# EAGLE design stacja prototyp (EAGLE 9.2.2)
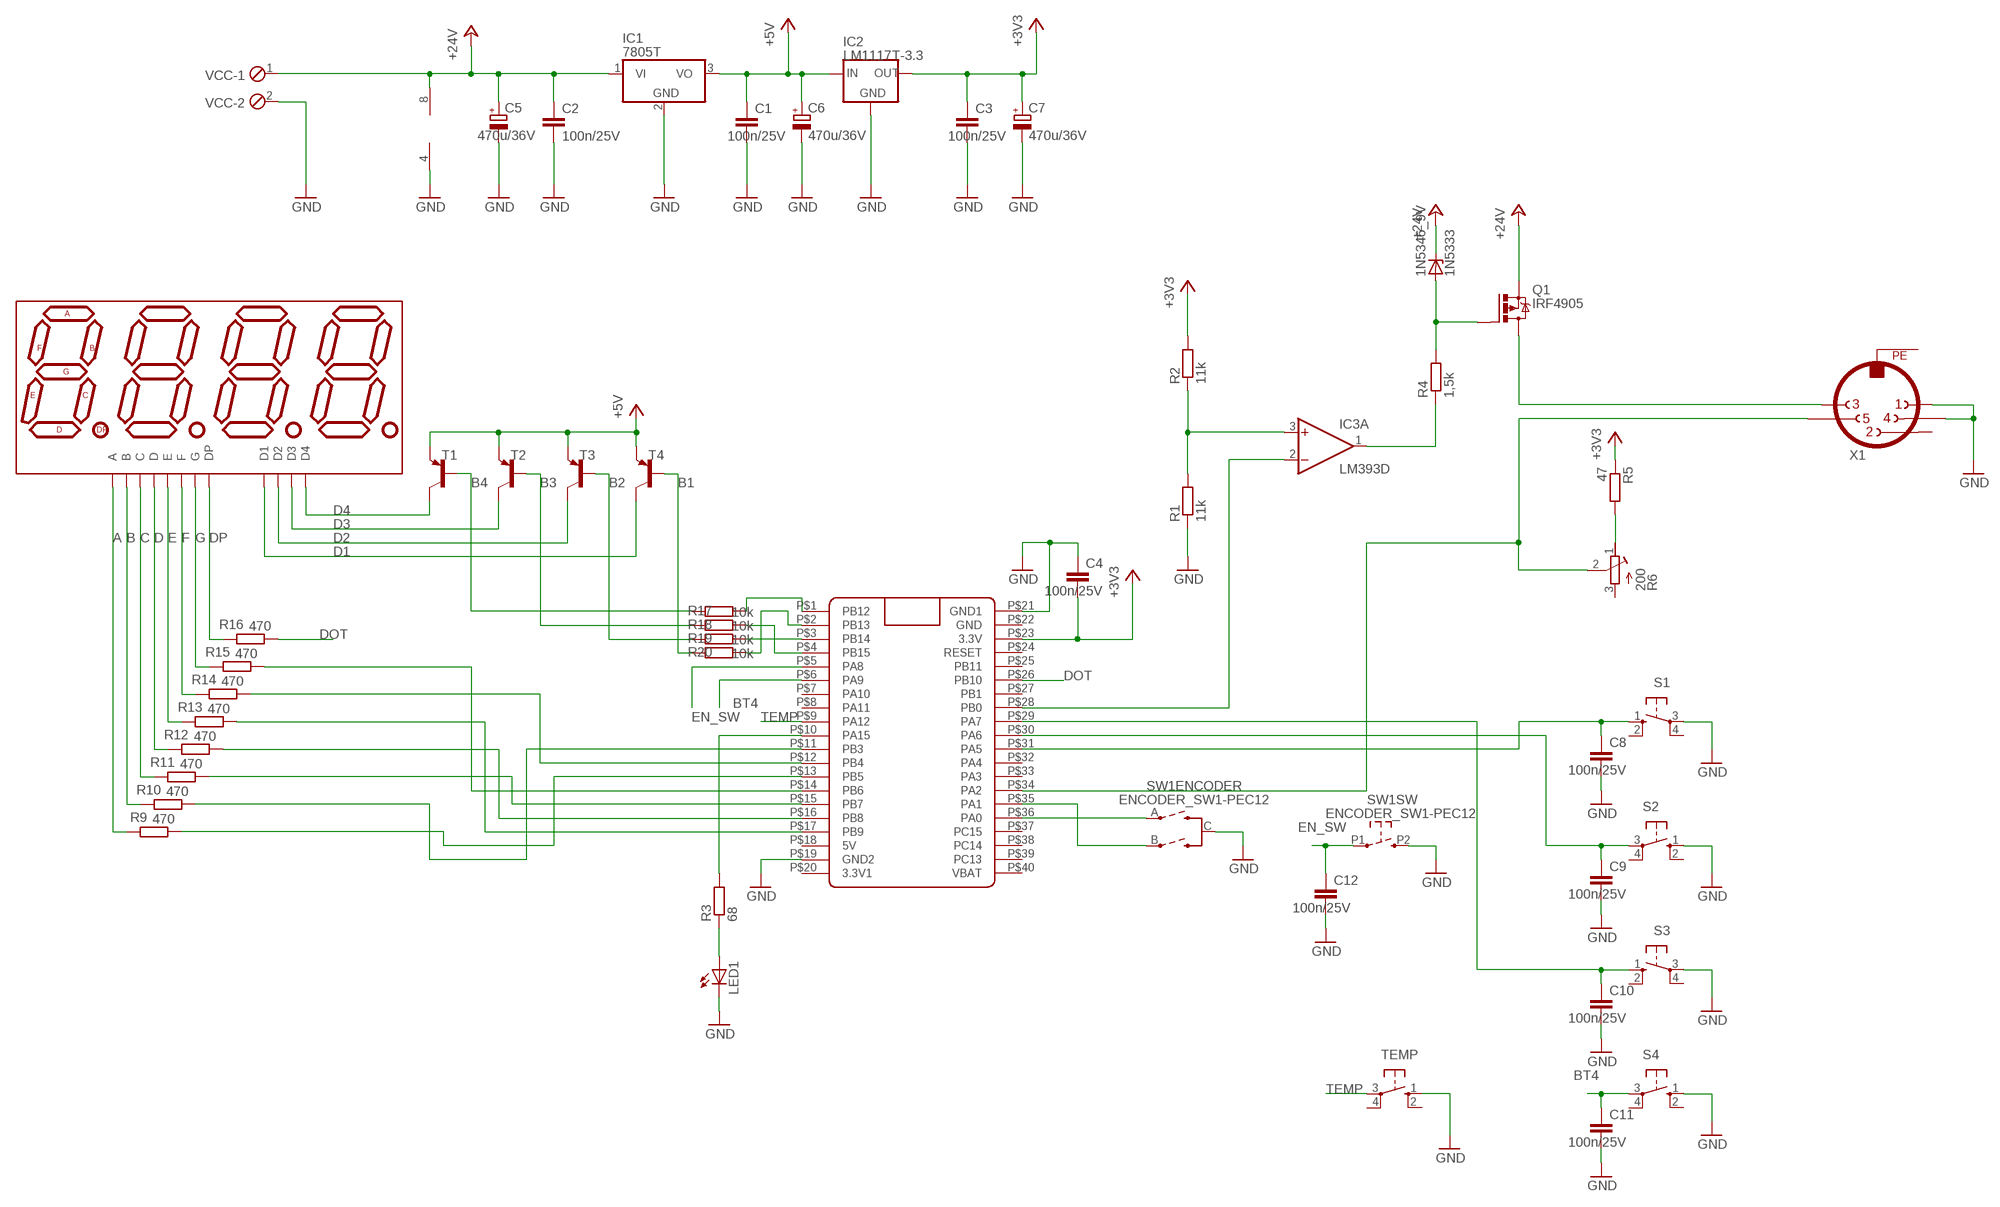
[diagram p0: schematic, sheet 1]

## Parts
1N5346_9V  1N5333  [C1702-15]
C1  100n/25V  C-EUC1206  [C1206]
C2  100n/25V  C-EUC1206  [C1206]
C3  100n/25V  C-EUC1206  [C1206]
C4  100n/25V  C-EUC1206  [C1206]
C5  470u/36V  CPOL-EUE2.5-5  [E2,5-5]
C6  470u/36V  CPOL-EUE2.5-5  [E2,5-5]
C7  470u/36V  CPOL-EUE2.5-5  [E2,5-5]
C8  100n/25V  C-EUC1206  [C1206]
C9  100n/25V  C-EUC1206  [C1206]
C10  100n/25V  C-EUC1206  [C1206]
C11  100n/25V  C-EUC1206  [C1206]
C12  100n/25V  C-EUC1206  [C1206]
DISP1  ATA8041ARBJ  7-SEGMENT-4DIGIT-20MM-RED  [7-SEGMENT-4DIGIT-20MM]
IC1  7805T  [TO220H]
IC2  LM1117T-3.3  [TO220]
IC3  LM393D  [SO08]
LED1  LED5MM  [LED5MM]
Q1  IRF4905  [TO220BH]
R1  11k  R-EU_R0805  [R0805]
R2  11k  R-EU_R0805  [R0805]
R3  68  R-EU_R0805  [R0805]
R4  1,5k  R-EU_0207/15  [0207/15]
R5  47  R-EU_0207/15  [0207/15]
R6  200  R-TRIMM43P  [RTRIM43P]
R9  470  R-EU_M0805  [M0805]
R10  470  R-EU_M0805  [M0805]
R11  470  R-EU_M0805  [M0805]
R12  470  R-EU_M0805  [M0805]
R13  470  R-EU_M0805  [M0805]
R14  470  R-EU_M0805  [M0805]
R15  470  R-EU_M0805  [M0805]
R16  470  R-EU_M0805  [M0805]
R17  10k  R-EU_M0805  [M0805]
R18  10k  R-EU_M0805  [M0805]
R19  10k  R-EU_M0805  [M0805]
R20  10k  R-EU_M0805  [M0805]
S1  10-XX  [B3F-10XX]
S2  10-XX  [B3F-10XX]
S3  10-XX  [B3F-10XX]
S4  10-XX  [B3F-10XX]
SW1  ENCODER_SW1-PEC12  [PEC12_INCREMENTAL_ENCODER]
T1  BC857B-PNP-SOT23-BEC  [SOT23-BEC]
T2  BC857B-PNP-SOT23-BEC  [SOT23-BEC]
T3  BC857B-PNP-SOT23-BEC  [SOT23-BEC]
T4  BC857B-PNP-SOT23-BEC  [SOT23-BEC]
TEMP  10-XX  [B3F-10XX]
U$1  BLUE_PILL  [BLUE_PILL]
VCC  MPT2  [2POL254]
X1  MAB5SV  [MAB5SV]

## Nets
+3V3: C3.1 C4.2 C7.+ IC2.2(OUT) R2.2 R5.1 U$1.P$23(3.3V)
+5V: C1.1 C6.+ IC1.3(VO) IC2.3(IN) T1.E T2.E T3.E T4.E
+24V: 1N5346_9V.C C2.1 C5.+ IC1.1(VI) IC3.8(P:V+) Q1.S VCC.1
A: DISP1.11(A) R9.2
B: DISP1.7(B) R10.2
B1: R20.2 T4.B
B2: R19.2 T3.B
B3: R18.2 T2.B
B4: R17.2 T1.B
BT4: C11.1 S4.3(P) U$1.P$6(PA9)
C: DISP1.4(C) R11.2
D: DISP1.2(D) R12.2
D1: DISP1.12(D1) T4.C
D2: DISP1.9(D2) T3.C
D3: DISP1.8(D3) T2.C
D4: DISP1.6(D4) T1.C
DOT: R16.1 U$1.P$26(PB10)
DP: DISP1.3(DP) R16.2
E: DISP1.1(E) R13.2
EN_SW: C12.1 SW1.P1 U$1.P$5(PA8)
F: DISP1.10(F) R14.2
G: DISP1.5(G) R15.2
GND: C1.2 C2.2 C3.2 C4.1 C5.- C6.- C7.- C8.2 C9.2 C10.2 C11.2 C12.2 IC1.2(GND) IC2.1(GND) IC3.4(P:V-) LED1.K(C) R1.1 S1.3(P) S2.1(S) S3.3(P) S4.1(S) SW1.C(ENCODER:C) SW1.P2 TEMP.1(S) U$1.P$19(GND2) U$1.P$21(GND1) VCC.2 X1.1 X1.4
N$1: IC3.2(A:-IN) U$1.P$28(PB0)
N$2: C8.1 S1.1(S) U$1.P$31(PA5)
N$3: C9.1 S2.3(P) U$1.P$30(PA6)
N$4: IC3.3(A:+IN) R1.2 R2.1
N$5: R6.2(S) U$1.P$34(PA2) X1.5
N$6: IC3.1(A:OUT) R4.1
N$7: 1N5346_9V.A Q1.G R4.2
N$8: Q1.D X1.3
N$9: SW1.A(ENCODER:A) U$1.P$36(PA0)
N$10: SW1.B(ENCODER:B) U$1.P$35(PA1)
N$11: LED1.A R3.1
N$12: R3.2 U$1.P$10(PA15)
N$13: R5.2 R6.1(E)
N$14: C10.1 S3.1(S) U$1.P$29(PA7)
N$15: R18.1 U$1.P$4(PB15)
N$16: R19.1 U$1.P$3(PB14)
N$17: R17.1 U$1.P$1(PB12)
N$18: R20.1 U$1.P$2(PB13)
N$19: R13.1 U$1.P$17(PB9)
N$20: R12.1 U$1.P$16(PB8)
N$21: R11.1 U$1.P$15(PB7)
N$22: R15.1 U$1.P$14(PB6)
N$23: R9.1 U$1.P$13(PB5)
N$24: R14.1 U$1.P$12(PB4)
N$25: R10.1 U$1.P$11(PB3)
TEMP: TEMP.3(P) U$1.P$9(PA12)
Unconnected: IC3.5(B:+IN) IC3.6(B:-IN) IC3.7(B:OUT) R6.3(A) S1.2(S1) S1.4(P1) S2.2(S1) S2.4(P1) S3.2(S1) S3.4(P1) S4.2(S1) S4.4(P1) TEMP.2(S1) TEMP.4(P1) U$1.P$7(PA10) U$1.P$8(PA11) U$1.P$18(5V) U$1.P$20(3.3V1) U$1.P$22(GND) U$1.P$24(RESET) U$1.P$25(PB11) U$1.P$27(PB1) U$1.P$32(PA4) U$1.P$33(PA3) U$1.P$37(PC15) U$1.P$38(PC14) U$1.P$39(PC13) U$1.P$40(VBAT) X1.2

## Power pins joined to a net without a drawn wire
PE: X1.PE

## Library data of the parts
1N5346_9V = diode:1N5333: Z DIODE 3.3 V, 5W, 5 percent (Motorola)
C1-C4 C8-C12 = rcl:C-EU: CAPACITOR, European symbol; SPICEPREFIX: C
C5-C7 = rcl:CPOL-EU: POLARIZED CAPACITOR, European symbol; SPICEPREFIX: C
DISP1 = SparkFun-LED:7-SEGMENT-4DIGIT-20MM: 4 Digit 7 Segment Display This is a part for the 4-Digit 7-segment LEDs from Young Sun. Different from the Digikey LEDs, all 16 pins are used. The LONGPADS Variant is used for a test jig, but you may like it because there is more pad to solder to. If you are concerned about routing space, the standard works just fine though. Datasheets: Red <http://cdn.sparkfun.com/datasheets/Components/LED/1LEDREDCC.pdf> Yellow <http://cdn.sparkfun.com/datasheets/Components/LED/1LEDYELCC.pdf> Green <http://cdn.sparkfun.com/datasheets/Components/LED/1LEDGRNCC.pdf> Blue <http://cdn.sparkfun.com/datasheets/Components/LED/1LEDBLUCC.pdf> White <http://cdn.sparkfun.com/datasheets/Components/LED/1LEDWHTCC.pdf> SparkFun Products Raw Components 7-Segment Display - 20mm (Red) <https://www.sparkfun.com/products/11405> (COM-11405) 7-Segment Display - 20mm (Yellow) <https://www.sparkfun.com/products/11406> (COM-11406) 7-Segment Display - 20mm (Green) <https://www.sparkfun.com/products/11407> (COM-11407) 7-Segment Display - 20mm (Blue) <https://www.sparkfun.com/products/11408> (COM-11408) 7-Segment Display - 20mm (White) <https://www.sparkfun.com/products/11409> (COM-11409) Serial Controlled SparkFun OpenSegment Serial Display - 20mm (Red) <https://www.sparkfun.com/products/11644> (COM-11644) SparkFun OpenSegment Serial Display - 20mm (Yellow) <https://www.sparkfun.com/products/11645> (COM-11645) SparkFun OpenSegment Serial Display - 20mm (Green) <https://www.sparkfun.com/products/11646> (COM-11646) SparkFun OpenSegment Serial Display - 20mm (Blue) <https://www.sparkfun.com/products/11647> (COM-11647) SparkFun OpenSegment Serial Display - 20mm (White) <https://www.sparkfun.com/products/11648> (COM-11648) Other SparkFun OpenSegment Shield <https://www.sparkfun.com/products/13190> (DEV-13190); PROD_ID: COMP-11449
IC1 = linear:78*: Positive VOLTAGE REGULATOR Source: http://cache.national.com/ds/LM/LM78L05.pdf http://www.fairchildsemi.com/ds/LM/LM7805.pdf
IC2 = lm1117:LM1117T-*
IC3 = linear:LM393: COMPARATOR
LED1 = adafruit:LED: LED OSRAM: - CHIPLED LG R971, LG N971, LY N971, LG Q971, LY Q971, LO R971, LY R971 LH N974, LH R974 LS Q976, LO Q976, LY Q976 LO Q996 - Hyper CHIPLED LW Q18S LB Q993, LB Q99A, LB R99A - SideLED LS A670, LO A670, LY A670, LG A670, LP A670 LB A673, LV A673, LT A673, LW A673 LH A674 LY A675 LS A676, LA A676, LO A676, LY A676, LW A676 LS A679, LY A679, LG A679 - Hyper Micro SIDELED® LS Y876, LA Y876, LO Y876, LY Y876 LT Y87S - SmartLED LW L88C, LW L88S LB L89C, LB L89S, LG L890 LS L89K, LO L89K, LY L89K LS L896, LA L896, LO L896, LY L896 - TOPLED LS T670, LO T670, LY T670, LG T670, LP T670 LSG T670, LSP T670, LSY T670, LOP T670, LYG T670 LG T671, LOG T671, LSG T671 LB T673, LV T673, LT T673, LW T673 LH T674 LS T676, LA T676, LO T676, LY T676, LB T676, LH T676, LSB T676, LW T676 LB T67C, LV T67C, LT T67C, LS T67K, LO T67K, LY T67K, LW E67C LS E67B, LA E67B, LO E67B, LY E67B, LB E67C, LV E67C, LT E67C LW T67C LS T679, LY T679, LG T679 LS T770, LO T770, LY T770, LG T770, LP T770 LB T773, LV T773, LT T773, LW T773 LH T774 LS E675, LA E675, LY E675, LS T675 LS T776, LA T776, LO T776, LY T776, LB T776 LHGB T686 LT T68C, LB T68C - Hyper Mini TOPLED® LB M676 - Mini TOPLED Santana® LG M470 LS M47K, LO M47K, LY M47K Source: http://www.osram.convergy.de/
Q1 = transistor-power:IRF4905: P-Channel HEXFET® Power MOSFET RDS(on)= 0.02 Ohm, ID = -74A Source: http://www.irf.com/product-info/datasheets/data/irf4905pbf.pdf
R1-R5 R9-R20 = rcl:R-EU_: RESISTOR, European symbol; SPICEPREFIX: R
R6 = rcl:R-TRIMM: Trimm resistor; SPICEMODEL: X; SPICEPREFIXL: POT
S1-S4 TEMP = switch-omron:10-XX: OMRON SWITCH; MPN: B3F-1000; OC_FARNELL: 176432; OC_NEWARK: 36M3542
SW1 = dp_devices:ENCODER_SW1: Incremental Encoder with push switch
T1-T4 = transistor:*-PNP-: PNP Transistror
U$1 = BluePill:BLUE_PILL
VCC = con-phoenix-254:MPT2: PHOENIX CONNECTOR; OC_FARNELL: unknown; OC_NEWARK: unknown
X1 = con-hirschmann:MAB5SV: Female CONNECTOR 5 pins 90 deg. with shield, vertical (DIN41524); OC_FARNELL: unknown; OC_NEWARK: unknown

## Board
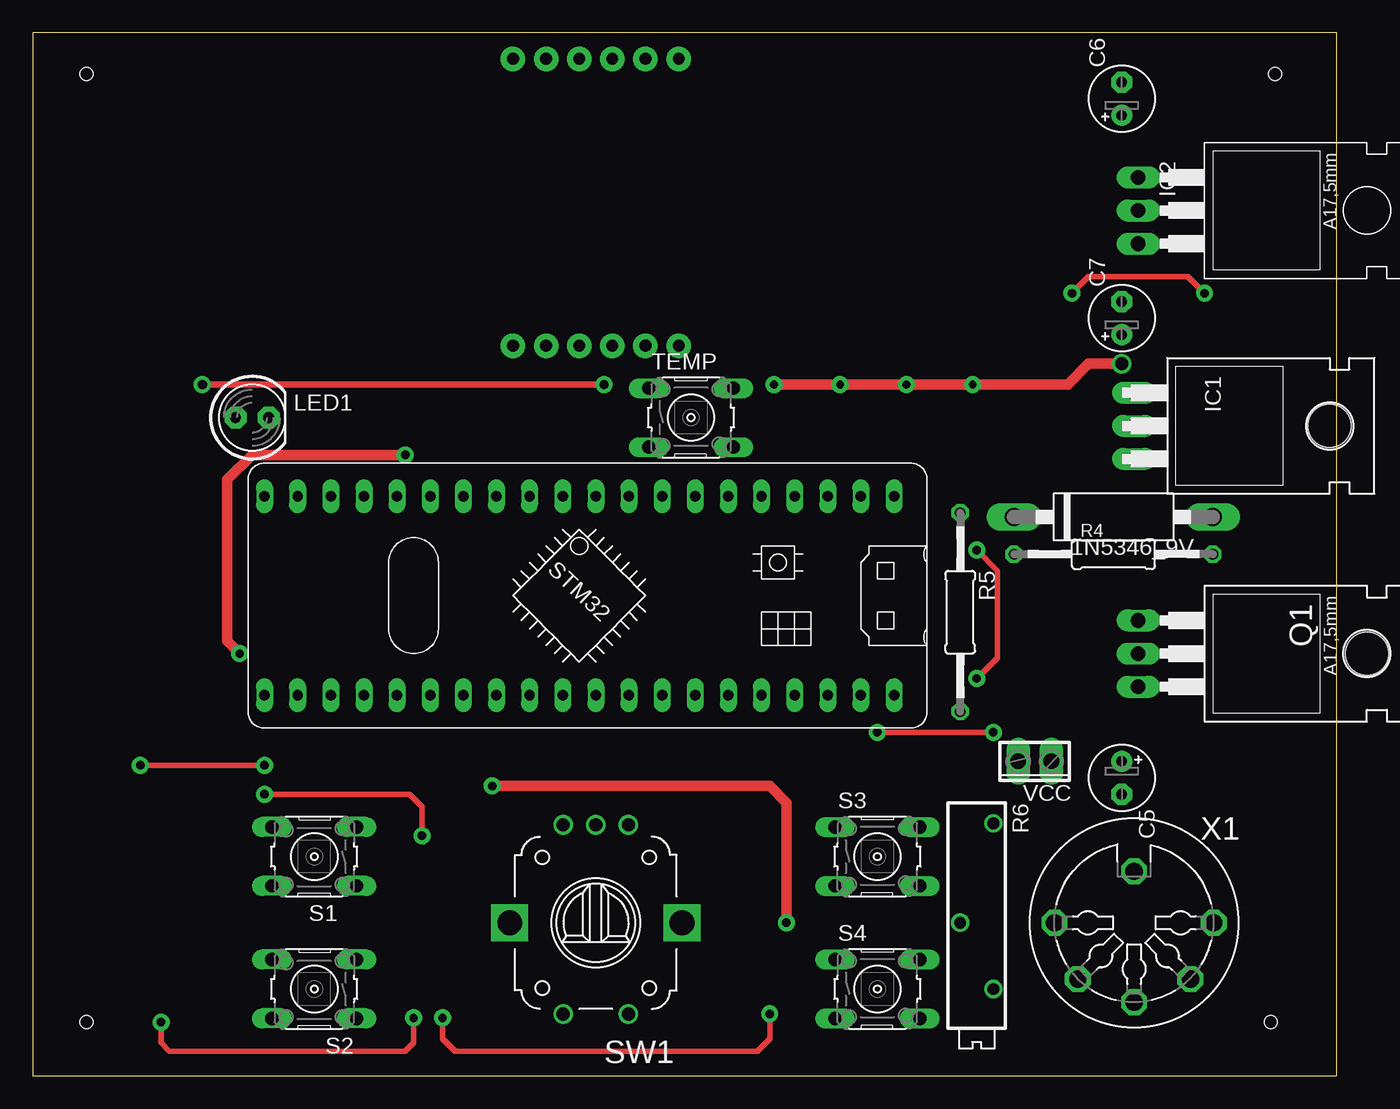
[diagram p1: board, top side]
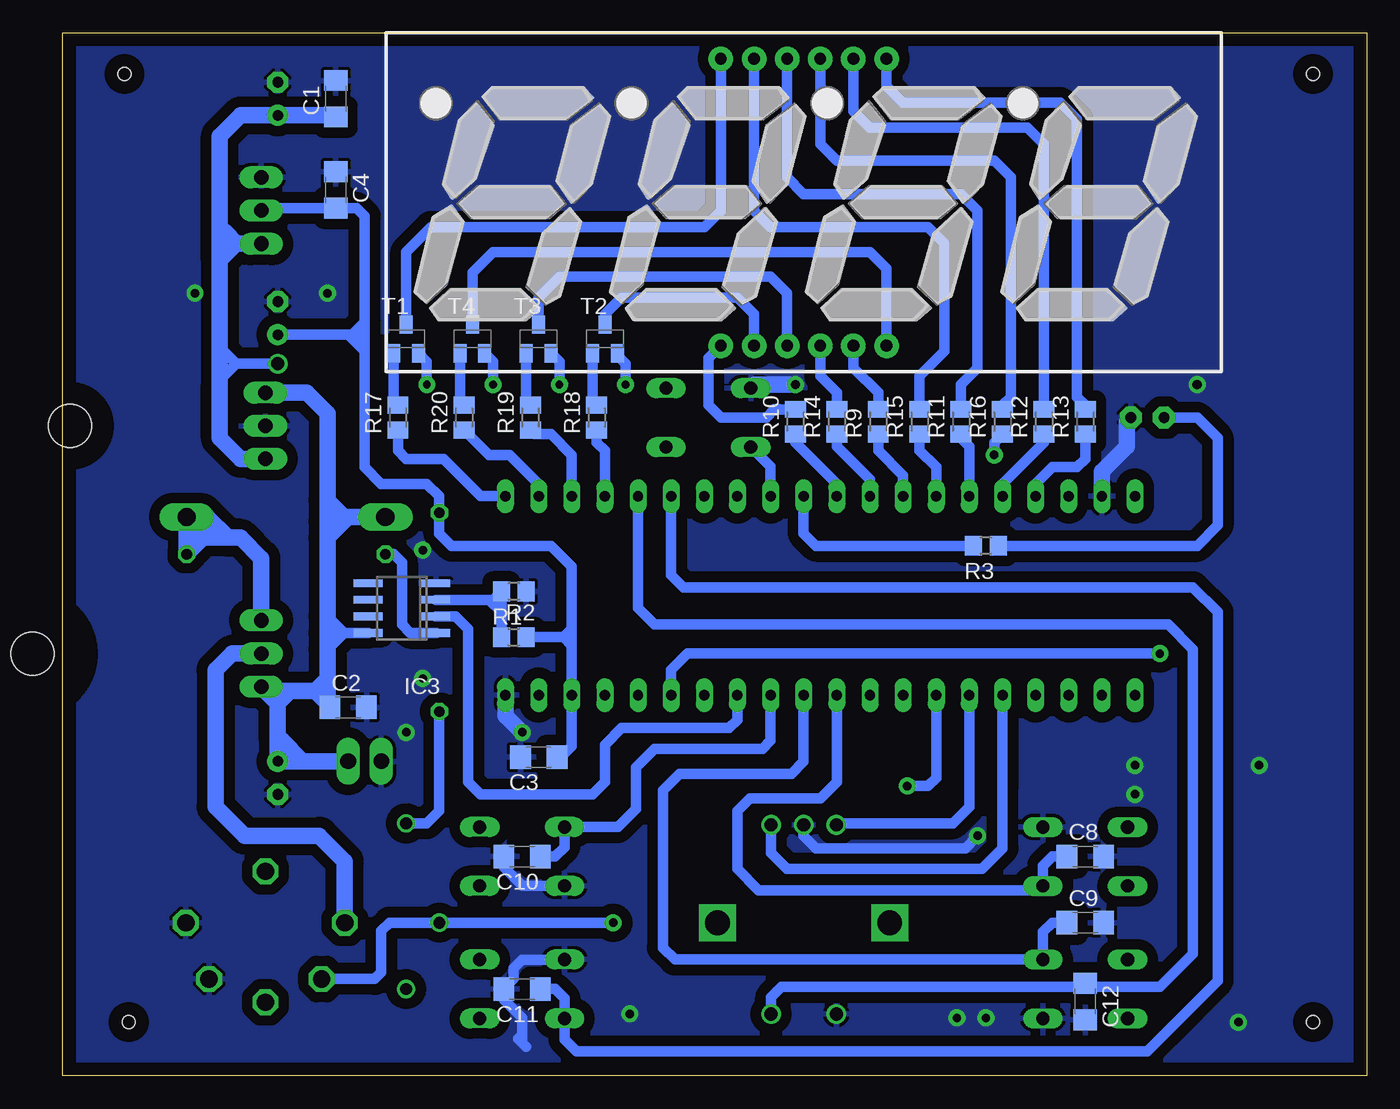
[diagram p2: board, bottom side, seen from below]

Size 100 x 80 mm. Coordinates in mm from the lower left corner, seen from the top.
Outline: 0,0 100,0 100,80 0,80 0,0
Copper layers (1*16): Top 0.035mm / dielectric 1.5mm / Bottom 0.035mm
Design rules "default": minimum track width 6mil, minimum drill 0.35mm, track to track 6mil, track to pad 6mil, pad to pad 6mil, via to via 6mil, smd to smd 6mil, copper to edge 40mil, drill to drill 6mil, minimum pad ring 10mil, minimum via ring 8mil, stop-mask expansion 4mil, vias tented up to drill 0mil, thermal gap 10mil
Holes 1 mm at 4.13,4.13 4.13,76.83 95.25,76.83 94.93,4.13

### Footprints (pad centres in the part's own frame; a part is rotated, then mirrored left to right if it is on the bottom)
C1702-15 = drill 1.397 long: A 7.62,0; C -7.62,0
C1206 = smd 1.6 x 1.8: 1 -1.4,0; 2 1.4,0
E2,5-5 = drill 0.813 pad 1.6: + -1.27,0 | drill 0.813 pad 1.6 octagon: - 1.27,0
7-SEGMENT-4DIGIT-20MM = drill 0.9 pad 1.88: 1 -6.35,-10.998; 2 -3.81,-10.998; 3 -1.27,-10.998; 4 1.27,-10.998; 5 3.81,-10.998; 6 6.35,-10.998; 7 6.35,10.998; 8 3.81,10.998; 9 1.27,10.998; 10 -1.27,10.998; 11 -3.81,10.998; 12 -6.35,10.998
TO220H = drill 1.118 long: 1 -2.54,-10.16; 2 0,-10.16; 3 2.54,-10.16 | hole 3.302: 0,4.826
TO220 = drill 1.118 long: 1 -2.54,-6.35; 2 0,-6.35; 3 2.54,-6.35
SO08 = smd 0.6 x 2.2: 1 -1.905,-2.6; 2 -0.635,-2.6; 3 0.635,-2.6; 4 1.905,-2.6; 5 1.905,2.6; 6 0.635,2.6; 7 -0.635,2.6; 8 -1.905,2.6
LED5MM = drill 0.813 pad 1.676 octagon: A -1.27,0; K 1.27,0
TO220BH = drill 1.118 long: D 0,-6.35; G -2.54,-6.35; S 2.54,-6.35 | hole 3.302: 0,11.176
R0805 = smd 1.3 x 1.5: 1 -0.95,0; 2 0.95,0
0207/15 = drill 0.813 octagon: 1 -7.62,0; 2 7.62,0
RTRIM43P = drill 0.9: 1 -7.62,1.27; 2 0,-1.27; 3 5.08,1.27
M0805 = smd 1.3 x 1.6: 1 -0.95,0; 2 0.95,0
B3F-10XX = drill 1.016 long: 1 -3.251,2.261; 2 3.251,2.261; 3 -3.251,-2.261; 4 3.251,-2.261
PEC12_INCREMENTAL_ENCODER = drill 1: A -2.5,-7.5; B 2.5,-7.5; C 0,-7.5; P1 -2.5,7; P2 2.5,7 | drill 1.9 square: GND@1 -6.6,0; GND@2 6.6,0
SOT23-BEC = smd 1 x 1.4: B -0.95,-1.1; C 0,1.1; E 0.95,-1.1
BLUE_PILL = drill 0.8 long: P$1 -7.62,15.24; P$2 -7.62,12.7; P$3 -7.62,10.16; P$4 -7.62,7.62; P$5 -7.62,5.08; P$6 -7.62,2.54; P$7 -7.62,0; P$8 -7.62,-2.54; P$9 -7.62,-5.08; P$10 -7.62,-7.62; P$11 -7.62,-10.16; P$12 -7.62,-12.7; P$13 -7.62,-15.24; P$14 -7.62,-17.78; P$15 -7.62,-20.32; P$16 -7.62,-22.86; P$17 -7.62,-25.4; P$18 -7.62,-27.94; P$19 -7.62,-30.48; P$20 -7.62,-33.02; P$21 7.62,15.24; P$22 7.62,12.7; P$23 7.62,10.16; P$24 7.62,7.62; P$25 7.62,5.08; P$26 7.62,2.54; P$27 7.62,0; P$28 7.62,-2.54; P$29 7.62,-5.08; P$30 7.62,-7.62; P$31 7.62,-10.16; P$32 7.62,-12.7; P$33 7.62,-15.24; P$34 7.62,-17.78; P$35 7.62,-20.32; P$36 7.62,-22.86; P$37 7.62,-25.4; P$38 7.62,-27.94; P$39 7.62,-30.48; P$40 7.62,-33.02
2POL254 = drill 1.2 long: 1 -1.27,0; 2 1.27,0
MAB5SV = drill 1.321 octagon: 1 6.096,0; 2 0,-6.096; 3 -6.096,0; 4 4.318,-4.318; 5 -4.318,-4.318; PE 0,3.937

### Placement (x,y rotation side)
1N5346_9V  82.87,42.86 0 top
C1  79.06,74.93 90 bottom
C2  78.11,28.26 0 bottom
C3  63.5,24.45 180 bottom
C4  79.06,67.94 270 bottom
C5  83.5,22.86 270 top
C6  83.5,74.93 90 top
C7  83.5,58.1 90 top
C8  21.59,16.83 0 bottom
C9  21.59,11.75 0 bottom
C10  64.77,16.83 180 bottom
C11  64.77,6.67 180 bottom
C12  21.59,5.71 270 bottom
DISP1  43.18,66.99 180 bottom
IC1  94.61,49.85 270 top
IC2  91.12,66.36 270 top
IC3  73.98,35.88 90 bottom
LED1  16.83,50.48 0 top
Q1  91.12,32.38 270 top
R1  65.41,37.15 180 bottom
R2  65.41,33.66 0 bottom
R3  29.21,40.64 180 bottom
R4  82.87,40.01 0 top
R5  71.12,35.56 270 top
R6  72.39,11.75 270 top
R9  37.47,50.16 90 bottom
R10  43.81,50.16 90 bottom
R11  31.11,50.16 90 bottom
R12  24.77,50.16 90 bottom
R13  21.59,50.16 90 bottom
R14  40.64,50.16 90 bottom
R15  34.29,50.16 90 bottom
R16  27.94,50.16 90 bottom
R17  74.3,50.48 90 bottom
R18  59.05,50.48 90 bottom
R19  64.14,50.48 90 bottom
R20  69.22,50.48 90 bottom
S1  21.59,16.83 180 top
S2  21.59,6.67 180 top
S3  64.77,16.83 0 top
S4  64.77,6.67 0 top
SW1  43.18,11.75 180 top
T1  73.66,56.52 0 bottom
T2  58.42,56.52 0 bottom
T3  63.5,56.52 0 bottom
T4  68.58,56.52 0 bottom
TEMP  50.48,50.48 0 top
U$1  50.8,36.83 270 top
VCC  76.83,24.13 180 top
X1  84.45,11.75 0 top

### Tracks (layer width: path | path; a pad name or v marks a point on that pad's centre or on a via)
+3V3
  Bottom 0.813: 60.96,33.02 U$1.P$23 60.96,25.27 61.78,24.45 C3.1 | 60.96,33.02 60.96,33.66 | 60.96,33.66 60.96,34.29 | 60.96,34.29 60.96,39.05 62.55,40.64 70.17,40.64 71.12,41.59 R5.1 71.12,44.45 72.07,45.4 75.56,45.4 76.83,46.67 76.83,55.56 | 78.11,56.83 C7.+ | R2.2 61.59,33.66 | 61.59,33.66 60.96,33.66 | 61.59,33.66 60.96,34.29 | 61.59,33.66 60.96,33.02 | 78.11,56.83 76.83,55.56 | 76.83,57.78 76.83,56.83 | 76.83,56.83 76.83,55.56 | 78.11,56.83 77.79,56.83 | 77.79,56.83 76.83,57.78 | 77.79,56.83 76.83,56.83 | 78.81,66.29 C4.2 | 76.83,57.78 76.83,65.91 77.47,66.55 C4.2 | C4.2 78.87,66.55 | C4.2 84.58,66.55 IC2.2
+5V  (via drill 0.6 pad 1.3, 1 pad 0.95)
  Top 0.813: v56.83,53.02 v61.91,53.02 v66.99,53.02 v72.07,53.02 79.38,53.02 80.96,54.61 v83.5,54.61
  Bottom 0.813: T3.E 61.91,54.78 v61.91,53.02 | T4.E 66.99,54.78 v66.99,53.02 | T1.E 72.07,54.78 v72.07,53.02 | v83.5,54.61 86.68,54.61 | 86.68,54.61 87.95,55.88 | 86.68,54.61 87.95,53.34 87.95,53.02 | v56.83,53.02 56.83,54.61 57.47,55.25 T2.E
  Bottom 1.27: IC2.3 86.68,63.82 | 86.68,63.82 87.95,62.55 | 87.95,62.55 87.95,55.88 87.95,53.02 87.95,48.9 86.36,47.31 IC1.3 | 87.95,62.55 87.95,64.77 | 87.95,64.77 87.95,72.07 86.36,73.66 C6.+ 79.19,73.66 C1.1 | 86.68,63.82 87.63,64.77 87.95,64.77
+24V
  Bottom 0.813: IC3.8 78.42,33.97 | 78.42,33.97 79.69,33.97 | 78.42,33.97 79.69,35.24 | 78.42,33.97 79.69,32.7
  Bottom 1.27: 83.5,25.72 C5.+ 81.6,24.13 | 80.64,29.53 79.69,28.57 | C2.1 79.44,28.33 79.69,28.57 | IC1.1 81.28,52.39 79.69,50.8 79.69,44.13 | 79.69,30.48 79.69,32.7 79.69,33.97 79.69,35.24 79.69,41.27 | 79.69,30.48 79.69,28.57 | 80.64,29.53 79.69,30.48 | VCC.1 81.6,24.13 | 81.6,24.13 83.19,25.72 83.5,25.72 | 79.69,44.13 79.69,42.55 | 79.69,42.55 79.69,41.27 | 1N5346_9V.C 78.11,42.86 | 78.42,42.86 79.38,42.86 79.69,42.55 | 78.11,42.86 78.42,42.86 | 78.42,42.86 79.69,44.13 | 78.11,42.86 79.69,41.27 | 80.64,29.53 82.55,29.53 | 82.55,29.53 83.5,29.53 | 83.5,29.53 84.45,29.53 Q1.S 83.5,28.57 | 83.5,25.72 83.5,28.57 | 83.5,28.57 83.5,29.53 | 83.5,28.57 82.55,29.53
A
  Bottom 0.813: DISP1.11 39.37,54.29 37.47,52.39 R9.2
B
  Bottom 0.813: R10.2 45.08,51.12 45.09,51.12 45.4,51.12 46.04,50.48 49.53,50.48 50.48,51.44 50.48,55.04 DISP1.7
B1
  Bottom 0.813: T4.B 69.53,51.75 R20.2
B2
  Bottom 0.813: T3.B 64.45,51.75 R19.2
B3
  Bottom 0.813: T2.B 59.37,51.75 R18.2
B4
  Bottom 0.813: T1.B 74.61,51.75 R17.2
BT4
  Bottom 0.813: C11.1 62.23,6.67 61.52,5.96 S4.3 61.52,2.82 60.6,1.91 16.83,1.91 11.43,7.3 11.43,35.56 13.34,37.47 52.39,37.47 53.34,38.42 U$1.P$6
C
  Bottom 0.813: DISP1.4 44.45,68.9 43.18,67.63 31.11,67.63 29.84,66.36 29.84,54.29 31.11,53.02 R11.2
D
  Bottom 0.813: DISP1.2 39.37,73.98 38.1,72.71 26.04,72.71 24.77,71.44 R12.2
D1
  Bottom 0.813: DISP1.12 36.83,61.91 38.1,63.18 66.99,63.18 68.58,61.59 T4.C
D2
  Bottom 0.813: DISP1.9 44.45,60.01 45.72,61.28 61.91,61.28 63.5,59.69 T3.C
D3
  Bottom 0.813: DISP1.8 46.99,58.42 48.26,59.69 57.15,59.69 58.42,58.42 T2.C
D4
  Bottom 0.813: DISP1.6 49.53,66.36 50.8,65.09 71.75,65.09 73.66,63.18 T1.C
DOT  (via drill 0.65 pad 1.3)
  Top 0.813: v15.88,32.38 14.92,33.34 14.92,45.72 16.83,47.62 v28.57,47.62
  Bottom 0.813: R16.1 28.57,48.58 v28.57,47.62 | U$1.P$26 53.34,31.11 52.07,32.38 v15.88,32.38
DP
  Bottom 0.813: DISP1.3 41.91,71.44 40.64,70.17 28.57,70.17 27.3,68.9 27.3,52.07 27.94,51.44 R16.2
E
  Bottom 0.813: DISP1.1 36.83,75.88 35.56,74.61 23.5,74.61 22.23,73.34 22.23,52.07 21.59,51.44 R13.2
EN_SW
  Bottom 0.813: SW1.P1 45.68,6.02 44.88,6.82 21.89,6.82 | 21.89,6.82 C12.1 | 21.89,6.82 15.88,6.82 13.34,9.36 13.34,32.7 15.24,34.61 54.61,34.61 55.88,35.88 U$1.P$5
F
  Bottom 0.813: DISP1.10 41.91,53.66 40.64,52.39 R14.2
G
  Bottom 0.813: DISP1.5 46.99,66.36 45.72,65.09 33.66,65.09 32.38,63.82 32.38,55.56 34.29,53.66 R15.2
GND  (via drill 0.65 pad 1.3, 0.7 pad 1.3)
  Top 0.406: v17.78,23.81 v8.26,23.81 | v73.66,26.35 v64.77,26.35 | v79.69,60.01 80.96,61.28 88.58,61.28 v89.85,60.01 | v72.39,40.32 73.98,38.73 73.98,32.07 v72.39,30.48 | v29.21,4.45 29.21,2.54 28.57,1.91 10.48,1.91 9.84,2.54 v9.84,4.13 | v17.78,21.59 28.89,21.59 29.84,20.64 v29.84,18.41 | v56.52,4.76 56.52,2.86 55.56,1.91 32.38,1.91 31.43,2.86 v31.43,4.45
  Top 0.508: v43.81,53.02 v13.02,53.02
  Bottom 0.813: SW1.C 43.18,18.41 42.23,17.46 30.8,17.46 v29.84,18.41 | C10.2 66.17,16 64.73,14.57 S3.3 | S4.1 61.56,8.89 64.77,8.89 65.41,8.26 65.41,7.43 C11.2 66.17,5.84 64.77,4.45 64.77,3.17 | 64.77,3.17 65.09,2.86 64.77,2.54 | 64.45,2.22 64.77,2.54 | 64.77,2.54 64.77,3.17
  Bottom 1.27: TEMP.1 46.95,53.02 v43.81,53.02 | U$1.P$21 66.04,27.62 v64.77,26.35 | U$1.P$19 20.32,46.35 18.41,48.26 18.41,50.16 LED1.K
  pour Bottom (isolate 0.813): 0,80.01 100.01,80.01 100.01,0 0,0
N$1
  Bottom 0.813: IC3.2 69.85,35.24 68.9,34.29 68.9,22.54 67.94,21.59 59.37,21.59 58.42,22.54 58.42,25.4 57.15,26.67 48.9,26.67 48.26,27.3 U$1.P$28
N$2
  Bottom 0.813: U$1.P$31 40.64,22.54 41.91,21.27 47.31,21.27 48.26,20.32 48.26,15.88 46.63,14.25 25.16,14.25 S1.1 | S1.1 24.99,14.42 24.99,14.83 | S1.1 24.84,16.12 24.13,16.83 C8.1
N$3
  Bottom 0.813: U$1.P$30 43.18,24.13 44.13,23.18 52.7,23.18 53.98,21.91 53.98,9.84 53.06,8.93 25.14,8.93 24.99,9.08 S2.3 24.84,11.04 24.13,11.75 C9.1
N$4
  Bottom 0.813: 66.36,35.88 R1.2 66.99,36.51 | 66.36,35.88 66.36,35.56 | 66.36,35.56 R2.1 | IC3.3 67.31,36.51 | 67.31,36.51 66.99,36.51 | 66.99,36.51 66.36,35.88 | 67.31,36.51 66.36,35.56
N$5  (via drill 0.65 pad 1.3)
  Top 0.813: v57.78,11.75 57.78,20.95 56.52,22.23 v35.24,22.23
  Bottom 0.813: v57.78,11.75 R6.2 74.93,11.75 75.56,11.11 75.56,7.94 76.07,7.43 X1.5 | U$1.P$34 33.02,22.86 33.66,22.23 v35.24,22.23
N$6
  Bottom 0.813: R4.1 74.61,40.01 73.98,39.37 73.98,34.61 73.34,33.97 IC3.1
N$7
  Bottom 1.27: 1N5346_9V.A 90.49,41.27 | 90.49,41.27 R4.2 89.22,41.27 | 87.31,41.27 86.36,41.27 84.77,39.69 Q1.G | 87.31,41.27 88.9,41.27 | 89.22,41.27 90.49,41.27 | 88.9,41.27 89.22,41.27 | 88.9,41.27 1N5346_9V.A | 87.31,41.27 88.9,42.86 1N5346_9V.A
N$8
  Bottom 1.27: Q1.D 87,32.38 88.27,31.11 88.27,20.64 86.04,18.41 80.33,18.41 78.36,16.45 X1.3
N$9
  Bottom 0.813: SW1.A 45.68,17.11 44.45,15.88 29.53,15.88 27.94,17.46 27.94,22.23 U$1.P$36
N$10
  Bottom 0.813: SW1.B 40.56,19.37 31.75,19.37 30.48,20.64 30.48,22.23 U$1.P$35
N$11
  Bottom 0.813: R3.1 13.02,40.64 11.43,42.23 11.43,48.9 13.02,50.48 LED1.A
N$12
  Bottom 0.813: U$1.P$10 43.18,41.59 42.23,40.64 R3.2
N$13
  Bottom 0.813: R5.2 71.12,20.32 72.07,19.37 R6.1
N$14
  Bottom 0.813: U$1.P$29 45.72,25.72 46.35,25.08 54.61,25.08 56.04,23.65 56.04,20.48 57.43,19.09 S3.1 61.52,17.54 62.23,16.83 C10.1
N$15
  Bottom 0.813: R18.1 59.05,48.58 58.42,47.95 U$1.P$4
N$16
  Bottom 0.813: R19.1 63.81,49.21 62.55,49.21 60.96,47.62 U$1.P$3
N$17
  Bottom 0.813: U$1.P$1 67.94,44.45 70.8,47.31 73.66,47.31 74.3,47.94 R17.1
N$18
  Bottom 0.813: R20.1 67.31,47.62 65.72,47.62 63.5,45.4 U$1.P$2
N$19
  Bottom 0.813: U$1.P$17 25.4,45.4 24.13,46.67 22.23,46.67 21.59,47.31 R13.1
N$20
  Bottom 0.813: U$1.P$16 27.94,45.41 24.77,48.58 R12.1
N$21
  Bottom 0.813: R11.1 31.11,48.9 30.48,48.26 U$1.P$15
N$22
  Bottom 0.813: R15.1 34.29,47.94 33.02,46.67 U$1.P$14
N$23
  Bottom 0.813: R9.1 37.47,47.94 35.56,46.04 U$1.P$13
N$24
  Bottom 0.813: R14.1 40.64,48.26 38.1,45.72 U$1.P$12
N$25
  Bottom 0.813: R10.1 43.81,48.58 40.64,45.4 U$1.P$11
TEMP
  Bottom 0.813: TEMP.3 45.72,46.71 U$1.P$9